# Altium project ESP32_RELAY.PrjPcb
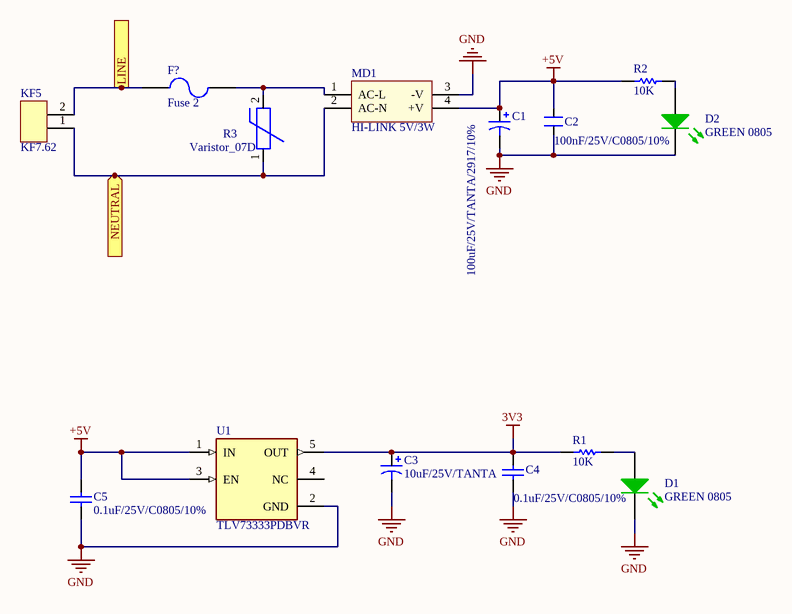
[diagram p0: [01]-POWER.SchDoc]
4 sheets, 92 parts. Net scope: flat (ports and power ports of the same name join across sheets).
Board file: PCB1.PcbDoc
Sheets:
  [01]-POWER.SchDoc
  [02]-ESP32.SchDoc
  [03]-USB-UART.SchDoc
  [04]-OUTPUT.SchDoc

## Sheet [01]-POWER.SchDoc
size A4; SheetNumber: 1; SheetTotal: 4

### Parts
C1  100uF/25V/TANTA/2917/10%  [CAP TANT CASE X SMD]
C2  100nF/25V/C0805/10%  [CAP_CERA_C2012(CC0805INCH)]
C3  10uF/25V/TANTA  [CAP TANT CASE B SMD]
C4  0.1uF/25V/C0805/10%  [CAP_CERA_C2012(CC0805INCH)]
C5  0.1uF/25V/C0805/10%  [CAP_CERA_C2012(CC0805INCH)]
D1  GREEN 0805  [Led 0805G]
D2  GREEN 0805  [Led 0805G]
F?  Fuse 2  [FUSE-BLX-A 5x20MM]
KF5  KF7.62  [KF-7.62]
MD1  HI-LINK 5V/3W  [HILINK 5V/3W]
R1  10K  [Res 0603 SMD]
R2  10K  [Res 0603 SMD]
R3  Varistor_07D  [Varistor_07D]
U1  TLV73333PDBVR  [SOT95P280X145-5N]

### Ports
LINE (in, see [04]-OUTPUT[2A], [04]-OUTPUT[2C], [04]-OUTPUT[4A], [04]-OUTPUT[4C]), NEUTRAL (in, see [04]-OUTPUT[2A], [04]-OUTPUT[2C], [04]-OUTPUT[4A], [04]-OUTPUT[4C])

### Nets
3V3: C3.1 C4.1 R1.1 U1.5(OUT)
+5V: C1.1 C2.2 C5.1 MD1.4(+V) R2.1 U1.1(IN) U1.3(EN)
GND: C1.2 C2.1 C3.2 C4.2 C5.2 D1.2(K) D2.2(K) MD1.3(-V) U1.2(GND)
LINE: F?.1 KF5.2 ; port LINE
NEUTRAL: KF5.1 MD1.2(AC-N) R3.1 ; port NEUTRAL
NetD1_1: D1.1(A) R1.2
NetD2_1: D2.1(A) R2.2
NetF?_2: F?.2 MD1.1(AC-L) R3.2

Not connected (* = marked no-connect by the designer): U1 4(NC)

### Notes on the sheet
- Title
- Size:
- Date:
- Author:
- A4
- Time:
- Number:
- Checked:
- Revision:
- Sheet
- Approved:
- of
- File:

### Library data of the parts
C1 = 100uF/6.3V/SIZE B/20%: CAP TANT 100UF 6.3V 20% 1411; Manufacturer: Kemet; Manufacturer Part Number: T491B107M006AT; Manufacturer Size Code: B; Capacitance: 100µF; ESR (Equivalent Series Resistance): 3 Ohm; Type: Molded; Lifetime @ Temp.: 2000 Hrs @ 85°C; RoHS: RoHS Compliant; Category: Capacitors; Packaging: Cut Tape (CT); Tolerance: ±20%; Voltage - Rated: 6.3V; Operating Temperature: -55°C ~ 125°C; Mounting Type: Surface Mount; Package / Case: 1411 (3528 Metric); Size / Dimension: 0.138" L x 0.110" W (3.50mm x 2.80mm); Height - Seated (Max): 0.083" (2.10mm); Lead Spacing: -; Features: General Purpose; ComponentLink1URL: http://www.kemet.com/Lists/ProductCatalog/Attachments/254/KEM_T2005_T491.pdf; ComponentLink1Description: http://www.kemet.com/Lists/ProductCatalog/Attachments/254/KEM_T2005_T491.pdf; Supplier 1: Digi-Key; Supplier Part Number 1: 399-3710-1-ND
C2 = CAP CERA 0805: CERAMIC CAP 0805; Value: 100pF, 2012
C3 = TAJB106M025RNJ: 10µF Molded Tantalum Capacitors 25V 1411 (3528 Metric) 3 Ohm; Manufacturer: KEMET; Digikey: 399-5125-1-ND
C4 C5 = 0.1uF/50V/C0603/10%_5: 0.1µF ±10% 25V Ceramic Capacitor X7R 0805 (2012 Metric); ComponentLink1URL: http://www.murata.com/~/media/webrenewal/support/library/catalog/products/capacitor/mlcc/c02e.ashx; ComponentLink1Description: http://www.murata.com/~/media/webrenewal/support/library/catalog/products/capacitor/mlcc/c02e.ashx; Digikey: 478-3755-1-ND
D1 D2 = LED GREEN 0603: Green 571nm LED Indication - Discrete 2V 0805 (2012 Metric); ComponentLink1URL: http://optoelectronics.liteon.com/upload/download/DS22-2000-074/S_110_LTST-C190KGKT.pdf; ComponentLink1Description: http://optoelectronics.liteon.com/upload/download/DS22-2000-074/S_110_LTST-C190KGKT.pdf; Digikey: 160-1426-1-ND
F? = Fuse 2: Fuse; Published: 8-Jun-2000; LatestRevisionDate: 17-Jul-2002; LatestRevisionNote: Re-released for DXP Platform.; PackageReference: PIN-W2/E2.8; Publisher: Altium Limited
KF5 = KF 2P
R1 R2 = 15K/R0603/1%_3: RES SMD 10K OHM 1% 1/10W 0603; Manufacturer: Yageo; Manufacturer Part Number: RC0603FR-0715KL; Resistance (Ohms): 15k; Power (Watts): 0.1W, 1/10W; Temperature Coefficient: ±100ppm/°C; RoHS: RoHS Compliant; Category: Resistors; Packaging: Digi-Reel®; Tolerance: ±1%; Composition: Thick Film; Features: Moisture Resistant; Operating Temperature: -55°C ~ 155°C; Package / Case: 0603 (1608 Metric); Supplier Device Package: 0603; Size / Dimension: 0.063" L x 0.031" W (1.60mm x 0.80mm); Height: 0.022" (0.55mm); Number of Terminations: 2; ComponentLink1URL: http://www.yageo.com/NewPortal/yageodocoutput?fileName=/pdf/R-Chip/PYu-RC_Group_51_RoHS_L_3.pdf; ComponentLink1Description: http://www.yageo.com/NewPortal/yageodocoutput?fileName=/pdf/R-Chip/PYu-RC_Group_51_RoHS_L_3.pdf; Supplier 1: Digi-Key; Supplier Part Number 1: 311-15.0KHRCT-ND
U1 = TLV73333PDBVR: 300-mA, capacitor-free, low-IQ, low-dropout voltage regulator with enable; MF: Texas Instruments; SnapEDA_Link: https://www.snapeda.com/parts/TLV73333PDBVR/Texas+Instruments/view-part/?ref=snap; Package: SOT-23-5 Texas Instruments; Value: *; MP: TLV73333PDBVR; Check_prices: https://www.snapeda.com/parts/TLV73333PDBVR/Texas+Instruments/view-part/?ref=eda

## Sheet [02]-ESP32.SchDoc
size A4; SheetNumber: 2; SheetTotal: 4
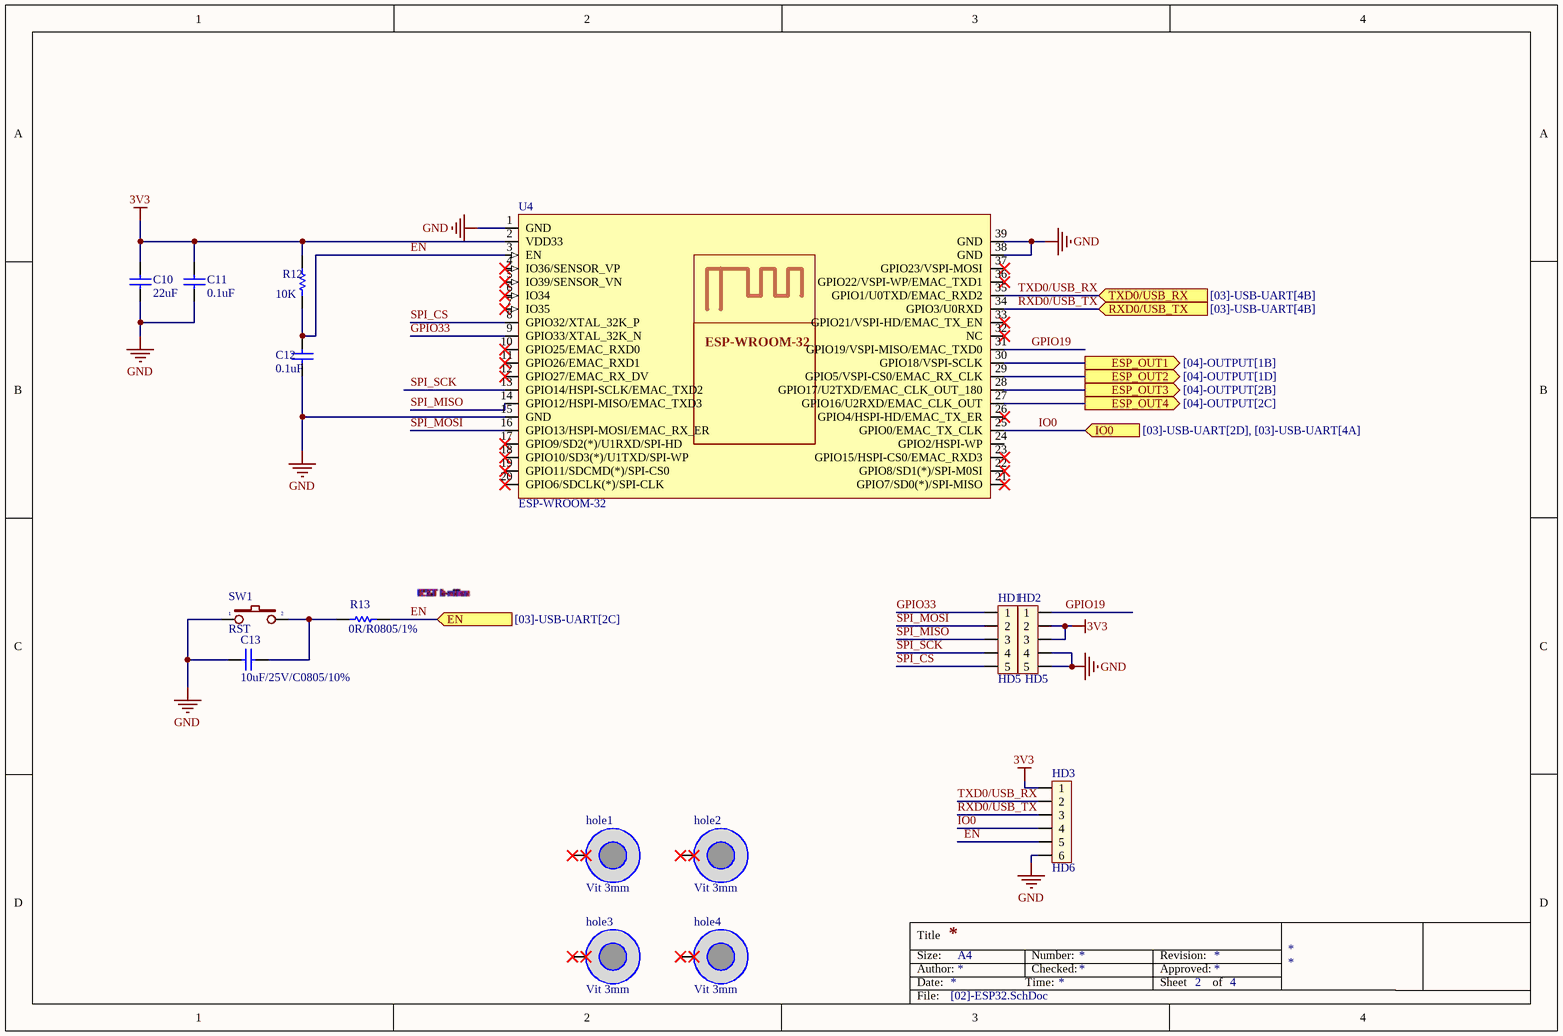
[diagram p1: [02]-ESP32.SchDoc]

### Parts
C10  22uF  [CAP_CERA_C2012(CC0805INCH)]
C11  0.1uF  [CAP_CERA_C2012(CC0805INCH)]
C12  0.1uF  [CAP_CERA_C2012(CC0805INCH)]
C13  10uF/25V/C0805/10%  [CAP_CERA_C2012(CC0805INCH)]
HD1  HD5  [Header_5]
HD2  HD5  [Header_5]
HD3  HD6  [Header_6]
hole1  Vit 3mm  [Screw 3.0]
hole2  Vit 3mm  [Screw 3.0]
hole3  Vit 3mm  [Screw 3.0]
hole4  Vit 3mm  [Screw 3.0]
R12  10K  [Res 0805 SMD]
R13  0R/R0805/1%  [Res 0805 SMD]
SW1  RST  [Button 3x4mm]
U4  ESP-WROOM-32  [ESP32 WROOM]

### Ports
EN (in, see [03]-USB-UART[2C]), ESP_OUT1 (out, see [04]-OUTPUT[1B]), ESP_OUT2 (out, see [04]-OUTPUT[1D]), ESP_OUT3 (out, see [04]-OUTPUT[2B]), ESP_OUT4 (out, see [04]-OUTPUT[2C]), IO0 (in, see [03]-USB-UART[2D], [03]-USB-UART[4A]), RXD0/USB_TX (in, see [03]-USB-UART[4B]), TXD0/USB_RX (in, see [03]-USB-UART[4B])

### Nets
3V3: C10.2 C11.2 HD2.2 HD2.3 HD3.1 R12.2 U4.2(VDD33)
GND: C10.1 C11.1 C12.1 C13.1 HD2.4 HD2.5 HD3.6 SW1.1 U4.1(GND) U4.15(GND) U4.38(GND) U4.39(GND)
EN: C12.2 HD3.5 R12.1 R13.2 U4.3(EN) ; port EN
ESP_OUT1: U4.30(GPIO18/VSPI-SCLK) ; port ESP_OUT1
ESP_OUT2: U4.29(GPIO5/VSPI-CS0/EMAC_RX_CLK) ; port ESP_OUT2
ESP_OUT3: U4.28(GPIO17/U2TXD/EMAC_CLK_OUT_180) ; port ESP_OUT3
ESP_OUT4: U4.27(GPIO16/U2RXD/EMAC_CLK_OUT) ; port ESP_OUT4
GPIO19: HD2.1 U4.31(GPIO19/VSPI-MISO/EMAC_TXD0)
GPIO33: HD1.1 U4.9(GPIO33/XTAL_32K_N)
IO0: HD3.4 U4.25(GPIO0/EMAC_TX_CLK) ; port IO0
RXD0/USB_TX: HD3.3 U4.34(GPIO3/U0RXD) ; port RXD0/USB_TX
SPI_CS: HD1.5 U4.8(GPIO32/XTAL_32K_P)
SPI_MISO: HD1.3 U4.14(GPIO12/HSPI-MISO/EMAC_TXD3)
SPI_MOSI: HD1.2 U4.16(GPIO13/HSPI-MOSI/EMAC_RX_ER)
SPI_SCK: HD1.4 U4.13(GPIO14/HSPI-SCLK/EMAC_TXD2)
TXD0/USB_RX: HD3.2 U4.35(GPIO1/U0TXD/EMAC_RXD2) ; port TXD0/USB_RX
NetC13_2: C13.2 R13.1 SW1.2

Not connected (* = marked no-connect by the designer): hole1 1(hole)*; hole2 1(hole)*; hole3 1(hole)*; hole4 1(hole)*; U4 4(IO36/SENSOR_VP)* 5(IO39/SENSOR_VN)* 6(IO34)* 7(IO35)* 10(GPIO25/EMAC_RXD0)* 11(GPIO26/EMAC_RXD1)* 12(GPIO27/EMAC_RX_DV)* 17(GPIO9/SD2(*)/U1RXD/SPI-HD)* 18(GPIO10/SD3(*)/U1TXD/SPI-WP)* 19(GPIO11/SDCMD(*)/SPI-CS0)* 20(GPIO6/SDCLK(*)/SPI-CLK)* 21(GPIO7/SD0(*)/SPI-MISO)* 22(GPIO8/SD1(*)/SPI-M0SI)* 23(GPIO15/HSPI-CS0/EMAC_RXD3)* 24(GPIO2/HSPI-WP) 26(GPIO4/HSPI-HD/EMAC_TX_ER)* 32(NC)* 33(GPIO21/VSPI-HD/EMAC_TX_EN)* 36(GPIO22/VSPI-WP/EMAC_TXD1)* 37(GPIO23/VSPI-MOSI)*

### Notes on the sheet
- Title
- Size:
- Date:
- Author:
- A4
- Time:
- Number:
- Checked:
- Revision:
- Sheet
- Approved:
- of
- File:

### Library data of the parts
C10 = 0.1uF/50V/C0603/10%_1: 22µF ±20% 25V Ceramic Capacitor X5R 0805 (2012 Metric); Manufacturer: Tariff Applied; ComponentLink1URL: http://www.murata.com/~/media/webrenewal/support/library/catalog/products/capacitor/mlcc/c02e.ashx; ComponentLink1Description: http://www.murata.com/~/media/webrenewal/support/library/catalog/products/capacitor/mlcc/c02e.ashx; Digikey: 1276-2908-1-ND
C11 C12 = 0.1uF/50V/C0603/10%_2: 0.1µF ±10% 25V Ceramic Capacitor X7R 0805 (2012 Metric); ComponentLink1URL: http://www.murata.com/~/media/webrenewal/support/library/catalog/products/capacitor/mlcc/c02e.ashx; ComponentLink1Description: http://www.murata.com/~/media/webrenewal/support/library/catalog/products/capacitor/mlcc/c02e.ashx; Digikey: 478-3755-1-ND
C13 = 0.1uF/50V/C0603/10%_6: 0.1µF ±10% 25V Ceramic Capacitor X7R 0805 (2012 Metric); ComponentLink1URL: http://www.murata.com/~/media/webrenewal/support/library/catalog/products/capacitor/mlcc/c02e.ashx; ComponentLink1Description: http://www.murata.com/~/media/webrenewal/support/library/catalog/products/capacitor/mlcc/c02e.ashx; Digikey: 478-3755-1-ND
HD1 HD2 = Header5: Header 5; Creat by: VanDungEvn@Gmail.com
HD3 = Header6: Header 6; Creat by: VanDungEvn@Gmail.com
R12 = 34.8K/R0805/1%_2: 10 kOhms ±1% 0.125W, 1/8W Chip Resistor 0805 (2012 Metric) Thick Film; Power Rating: 100mW; Resistance: 34.8kR; Voltage Rating: 50V; Case/Package: 0603; Case Code (Imperial): 0603; Case Code (Metric): 1608; Min Operating Temperature: -55°C; Max Operating Temperature: 155°C; Termination: SMD/SMT; Military Standard: Not; Voltage Rating (DC): 50V; Length: 1.6mm; Height: 0.45mm; Width: 0.8mm; Depth: 0.8mm; Lead Free: Lead Free; Digikey: A126332CT-ND
R13 = 200K/R0603/1%_1: 0 Ohms Jumper 0.125W, 1/8W Chip Resistor 0805 (2012 Metric) Automotive AEC-Q200 Thick Film; Part Status: Active; Height - Seated (Max): 0.022" (0.55mm); Failure Rate: -; ComponentLink1URL: http://www.yageo.com/documents/recent/PYu-RC_Group_51_RoHS_L_7.pdf; ComponentLink1Description: http://www.yageo.com/documents/recent/PYu-RC_Group_51_RoHS_L_7.pdf; Digikey: 541-0.0ACT-ND
SW1 = SW2: SWITCH TACTILE SPST-NO 0.05A 12V; Digikey: CKN10384CT-ND

## Sheet [03]-USB-UART.SchDoc
size A4; SheetNumber: 3; SheetTotal: 4
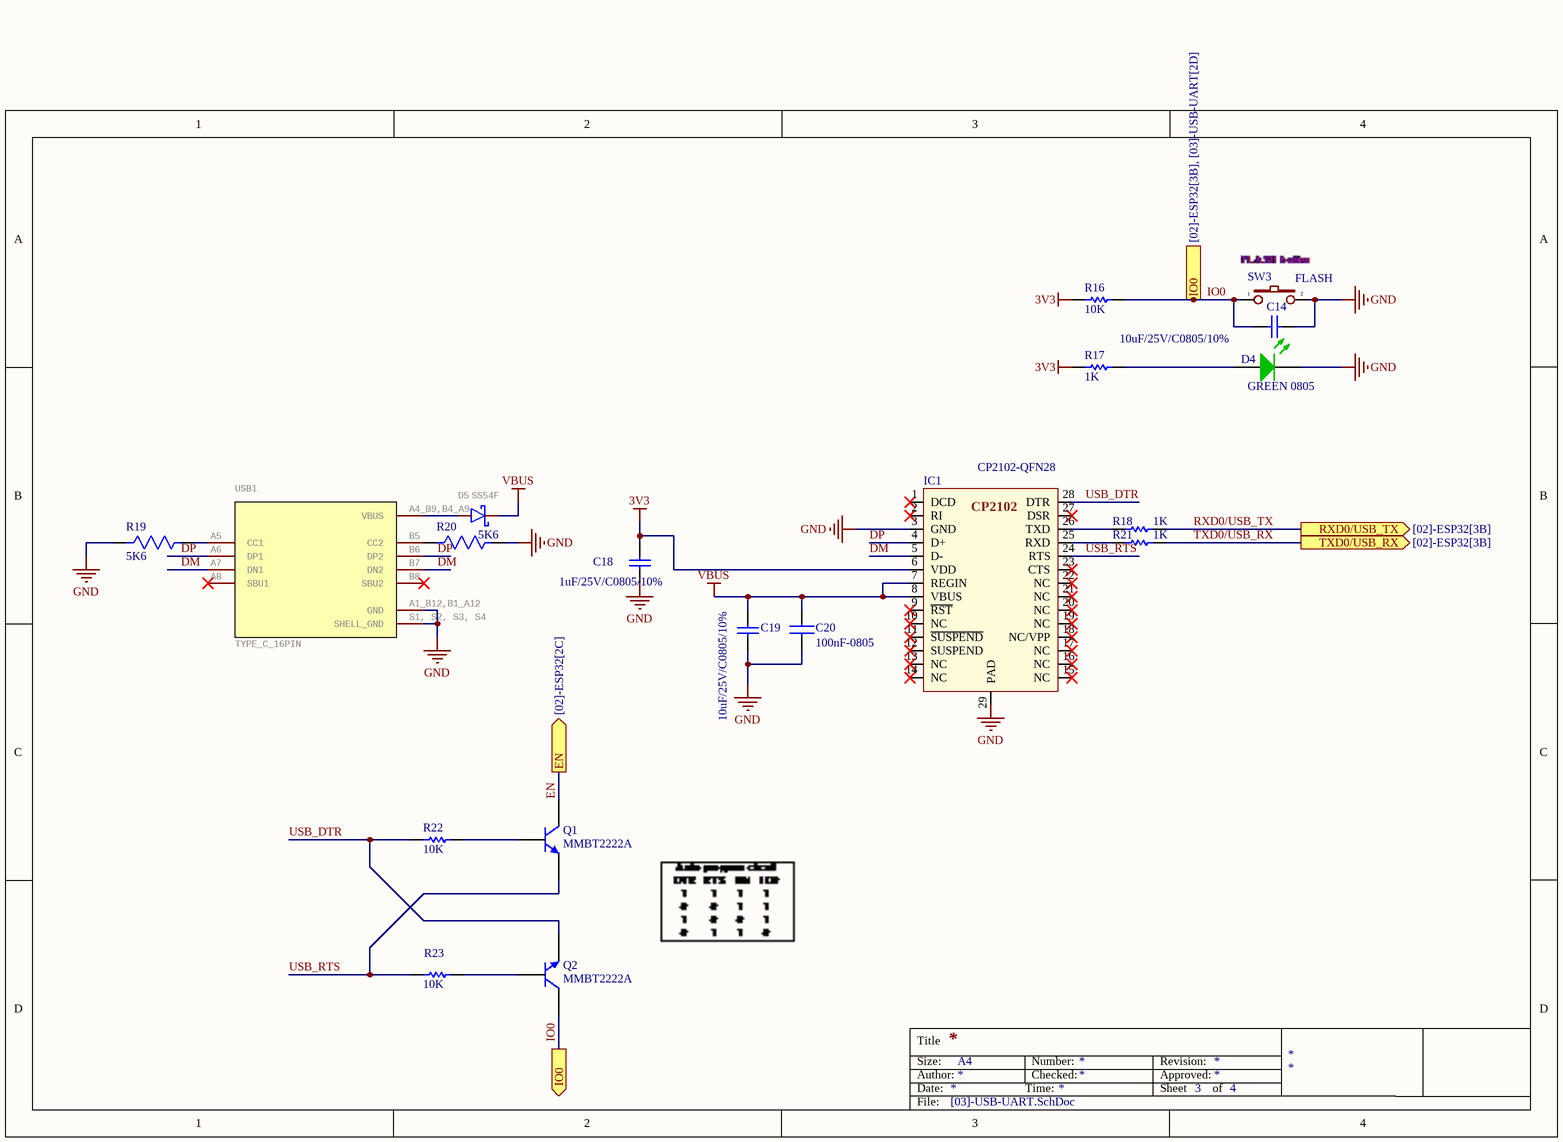
[diagram p2: [03]-USB-UART.SchDoc]

### Parts
C14  10uF/25V/C0805/10%  [CAP_CERA_C2012(CC0805INCH)]
C18  1uF/25V/C0805/10%  [CAP_CERA_C2012(CC0805INCH)]
C19  10uF/25V/C0805/10%  [CAP_CERA_C2012(CC0805INCH)]
C20  100nF-0805  [CAP0805]
D4  GREEN 0805  [Led 0805G]
D5  SS54F  [SMAF]
IC1  CP2102-QFN28  [CP2102-QFN28]
Q1  MMBT2222A  [SOT23-3]
Q2  MMBT2222A  [SOT23-3]
R16  10K  [Res 0805 SMD]
R17  1K  [Res 0805 SMD]
R18  1K  [Res 0603 SMD]
R19  5K6  [R0805]
R20  5K6  [R0805]
R21  1K  [Res 0603 SMD]
R22  10K  [Res 0805 SMD]
R23  10K  [Res 0805 SMD]
SW3  FLASH  [Button 3x4mm]
USB1  TYPE_C_16PIN  [USB_TYPEC_16PIN]

### Ports
EN (out, see [02]-ESP32[2C]), IO0 (out, see [02]-ESP32[3B], [03]-USB-UART[2D]), IO0 (out, see [02]-ESP32[3B], [03]-USB-UART[4A]), RXD0/USB_TX (out, see [02]-ESP32[3B]), TXD0/USB_RX (out, see [02]-ESP32[3B])

### Nets
3V3: C18.1 IC1.6(VDD) R16.1 R17.1
GND: C14.2 C18.2 C19.1 C20.2 D4.2(K) IC1.3(GND) IC1.29(PAD) R19.1 R20.2 SW3.2 USB1.A1_B12,B1_A12(GND) USB1.S1,_S2,_S3,_S4(SHELL_GND)
VBUS: C19.2 C20.1 D5.C IC1.7(REGIN) IC1.8(VBUS)
DM: IC1.5(D-) USB1.A7(DN1) USB1.B7(DN2)
DP: IC1.4(D+) USB1.A6(DP1) USB1.B6(DP2)
EN: Q1.3(C) ; port EN
IO0: C14.1 Q2.3(C) R16.2 SW3.1 ; port IO0
RXD0/USB_TX: R18.2 ; port RXD0/USB_TX
TXD0/USB_RX: R21.2 ; port TXD0/USB_RX
USB_DTR: IC1.28(DTR) Q2.2(E) R22.1
USB_RTS: IC1.24(RTS) Q1.2(E) R23.1
NetD4_1: D4.1(A) R17.2
NetD5_A: D5.A USB1.A4_B9,B4_A9(VBUS)
NetIC1_25: IC1.25(RXD) R21.1
NetIC1_26: IC1.26(TXD) R18.1
NetQ1_1: Q1.1(B) R22.2
NetQ2_1: Q2.1(B) R23.2
NetR19_2: R19.2 USB1.A5(CC1)
NetR20_1: R20.1 USB1.B5(CC2)

Not connected (* = marked no-connect by the designer): IC1 1(DCD)* 2(RI)* 9(~{RST})* 10(NC)* 11(~{SUSPEND})* 12(SUSPEND)* 13(NC)* 14(NC)* 15(NC)* 16(NC)* 17(NC)* 18(NC/VPP)* 19(NC)* 20(NC)* 21(NC)* 22(NC)* 23(CTS)* 27(DSR)*; USB1 A8(SBU1)* B8(SBU2)*

### Notes on the sheet
- Title
- Size:
- Date:
- Author:
- A4
- Time:
- Number:
- Checked:
- Revision:
- Sheet
- Approved:
- of
- File:

### Library data of the parts
C14 C18 C19 = 0.1uF/50V/C0603/10%_6: as C13 on sheet [02]-ESP32; ComponentLink1URL: http://www.murata.com/~/media/webrenewal/support/library/catalog/products/capacitor/mlcc/c02e.ashx; ComponentLink1Description: http://www.murata.com/~/media/webrenewal/support/library/catalog/products/capacitor/mlcc/c02e.ashx; Digikey: 478-3755-1-ND
C20 = CC0805KRX7R9BB104: CAP CER 0.1UF 50V X7R 0805; Manufacturer: Yageo; Tolerance: ±10%; Notification: Current market demand for these product types have resulted in fluctuating and extending lead times. Lead times may differ.; Supplier 1: Digi-Key; Manufacturer Part Number: CC0805KRX7R9BB104; RoHS: RoHS Compliant; Category: Capacitors; Stock 1: 0; Pricing 1: 1=0.13, 10=0.093, 100=0.0439, 500=0.03076, 1000=0.02547 (USD); Packaging: Cut Tape (CT); Part Status: Active; Voltage - Rated: 50V; Temperature Coefficient: X7R; Operating Temperature: -55°C ~ 125°C; Features: High Voltage; Ratings: -; Applications: General Purpose; Failure Rate: -; Mounting Type: Surface Mount, MLCC; Package / Case: 0805 (2012 Metric); Size / Dimension: 0.079" L x 0.049" W (2.00mm x 1.25mm); Height - Seated (Max): -; Thickness (Max): 0.033" (0.85mm); Lead Spacing: -; Lead Style: -; ComponentLink1URL: http://www.yageo.com/documents/recent/UPY-GPHC_X7R_6.3V-to-50V_18.pdf; ComponentLink1Description: http://www.yageo.com/documents/recent/UPY-GPHC_X7R_6.3V-to-50V_18.pdf; Supplier Part Number 1: 311-1140-1-ND
D4 = LED GREEN 0603: as D1 on sheet [01]-POWER; ComponentLink1URL: http://optoelectronics.liteon.com/upload/download/DS22-2000-074/S_110_LTST-C190KGKT.pdf; ComponentLink1Description: http://optoelectronics.liteon.com/upload/download/DS22-2000-074/S_110_LTST-C190KGKT.pdf; Digikey: 160-1426-1-ND
D5 = SS54F: GateName_1: G$1; SymbolName_1: DIODE_S; LibraryName: Uy_SMD; DeviceSetName: SS54F; Package: SMAF
IC1 = CP2102: USB Bridge, USB to UART USB 2.0 UART Interface 28-QFN (5x5); Digikey: 336-3694-ND; VNBuy: https://banlinhkien.vn/goods-2607-cp2102-qfn28.html
Q1 Q2 = MMBT2222A: TRANS NPN 40V 1A SOT-23; Manufacturer: ON Semiconductor; Vce Saturation (Max) @ Ib, Ic: 1V @ 50mA, 500mA; Current - Collector Cutoff (Max): 10nA (ICBO); DC Current Gain (hFE) (Min) @ Ic, Vce: 100 @ 150mA, 10V; Frequency - Transition: 300MHz; Supplier 1: Digi-Key; Manufacturer Part Number: MMBT2222A; RoHS: RoHS Compliant; Category: Discrete Semiconductor Products; Stock 1: 220769; Pricing 1: 1=0.21, 10=0.17, 100=0.09, 500=0.05922, 1000=0.04027 (USD); Packaging: Cut Tape (CT); Part Status: Last Time Buy; Transistor Type: NPN; Operating Temperature: 150°C (TJ); Mounting Type: Surface Mount; Package / Case: TO-236-3, SC-59, SOT-23-3; Supplier Device Package: SOT-23-3; Base Part Number: MMBT2222; ComponentLink1URL: https://www.fairchildsemi.com/datasheets/MM/MMBT2222A.pdf; ComponentLink1Description: https://www.fairchildsemi.com/datasheets/MM/MMBT2222A.pdf; Supplier Part Number 1: MMBT2222AFSCT-ND
R16 R22 R23 = 34.8K/R0805/1%_2: as R12 on sheet [02]-ESP32; Case/Package: 0603; Case Code (Imperial): 0603; Case Code (Metric): 1608; Min Operating Temperature: -55°C; Max Operating Temperature: 155°C; Termination: SMD/SMT; Military Standard: Not; Voltage Rating (DC): 50V; Length: 1.6mm; Height: 0.45mm; Width: 0.8mm; Depth: 0.8mm; Lead Free: Lead Free; Digikey: A126332CT-ND
R17 = 34.8K/R0805/1%: 1 kOhms ±1% 0.125W, 1/8W Chip Resistor 0805 (2012 Metric) Automotive AEC-Q200 Thick Film; Power Rating: 100mW; Resistance: 34.8kR; Voltage Rating: 50V; Case/Package: 0603; Case Code (Imperial): 0603; Case Code (Metric): 1608; Min Operating Temperature: -55°C; Max Operating Temperature: 155°C; Termination: SMD/SMT; Military Standard: Not; Voltage Rating (DC): 50V; Length: 1.6mm; Height: 0.45mm; Width: 0.8mm; Depth: 0.8mm; Lead Free: Lead Free; Digikey: 541-1.00KCCT-ND
R18 R21 = 15K/R0603/1%: RES SMD 1K OHM 1% 1/10W 0603; Manufacturer: Yageo; Manufacturer Part Number: RC0603FR-0715KL; Resistance (Ohms): 15k; Power (Watts): 0.1W, 1/10W; Temperature Coefficient: ±100ppm/°C; RoHS: RoHS Compliant; Category: Resistors; Packaging: Digi-Reel®; Tolerance: ±1%; Composition: Thick Film; Features: Moisture Resistant; Operating Temperature: -55°C ~ 155°C; Package / Case: 0603 (1608 Metric); Supplier Device Package: 0603; Size / Dimension: 0.063" L x 0.031" W (1.60mm x 0.80mm); Height: 0.022" (0.55mm); Number of Terminations: 2; ComponentLink1URL: http://www.yageo.com/NewPortal/yageodocoutput?fileName=/pdf/R-Chip/PYu-RC_Group_51_RoHS_L_3.pdf; ComponentLink1Description: http://www.yageo.com/NewPortal/yageodocoutput?fileName=/pdf/R-Chip/PYu-RC_Group_51_RoHS_L_3.pdf; Supplier 1: Digi-Key; Supplier Part Number 1: 311-15.0KHRCT-ND
R19 R20 = Resistor 0805: SMD Resistor 0805; Manufacturer: Yageo; Manufacturer Part Number: RC0603FR-071KL; Power Rating: 100mW; Tolerance: 1%; Temperature Coefficient: 100ppm/°C; Voltage Rating: 50V; Supplier: Digi-Key; Supplier Part Number: 311-1.00KHRDKR-ND; RoHS: Yes; Category: Chip SMD Resistors; Stock: 18662657; Pricing: 1=0.1, 10=0.018, 50=0.0106, 100=0.0088, 500=0.00592, 1000=0.00505 (USD); Case/Package: 0603; Case Code (Imperial): 0603; Case Code (Metric): 1608; Contact Plating: Tin,Matte; Min Operating Temperature: -55°C; Max Operating Temperature: 155°C; Packaging: Tape and Reel; Resistor Type: Thick Film; Termination: SMD/SMT; Features: Moisture Resistant; Series: RC; Max Power Dissipation: 100mW; Number of Terminations: 2; Resistance Tolerance: 1%; Construction: Rectangular; Technology: THICK FILM; Length: 1.6mm; Height: 0.45mm; Depth: 0.8mm; Reach SVHC Compliant: No; Military Standard: Not; Lead Free: 5697LeadFree; RoHS Compliant: Yes
SW3 = SW2: SWITCH TACTILE SPST-NO 0.05A 12V; Digikey: CKN10384CT-ND
USB1 = TYPE_C_16PIN: GateName_1: G$1; SymbolName_1: USB4105-GF-A; DeviceSetName: TYPE_C_FEMALE; MF: GCT; LibraryName: Uy_SMD; Package: GCT_USB4105-GF-A; AVAILABILITY: Warning; MP: USB4105-GF-A; PACKAGE: None; PRICE: None

## Sheet [04]-OUTPUT.SchDoc
size A4; SheetNumber: 4; SheetTotal: 4
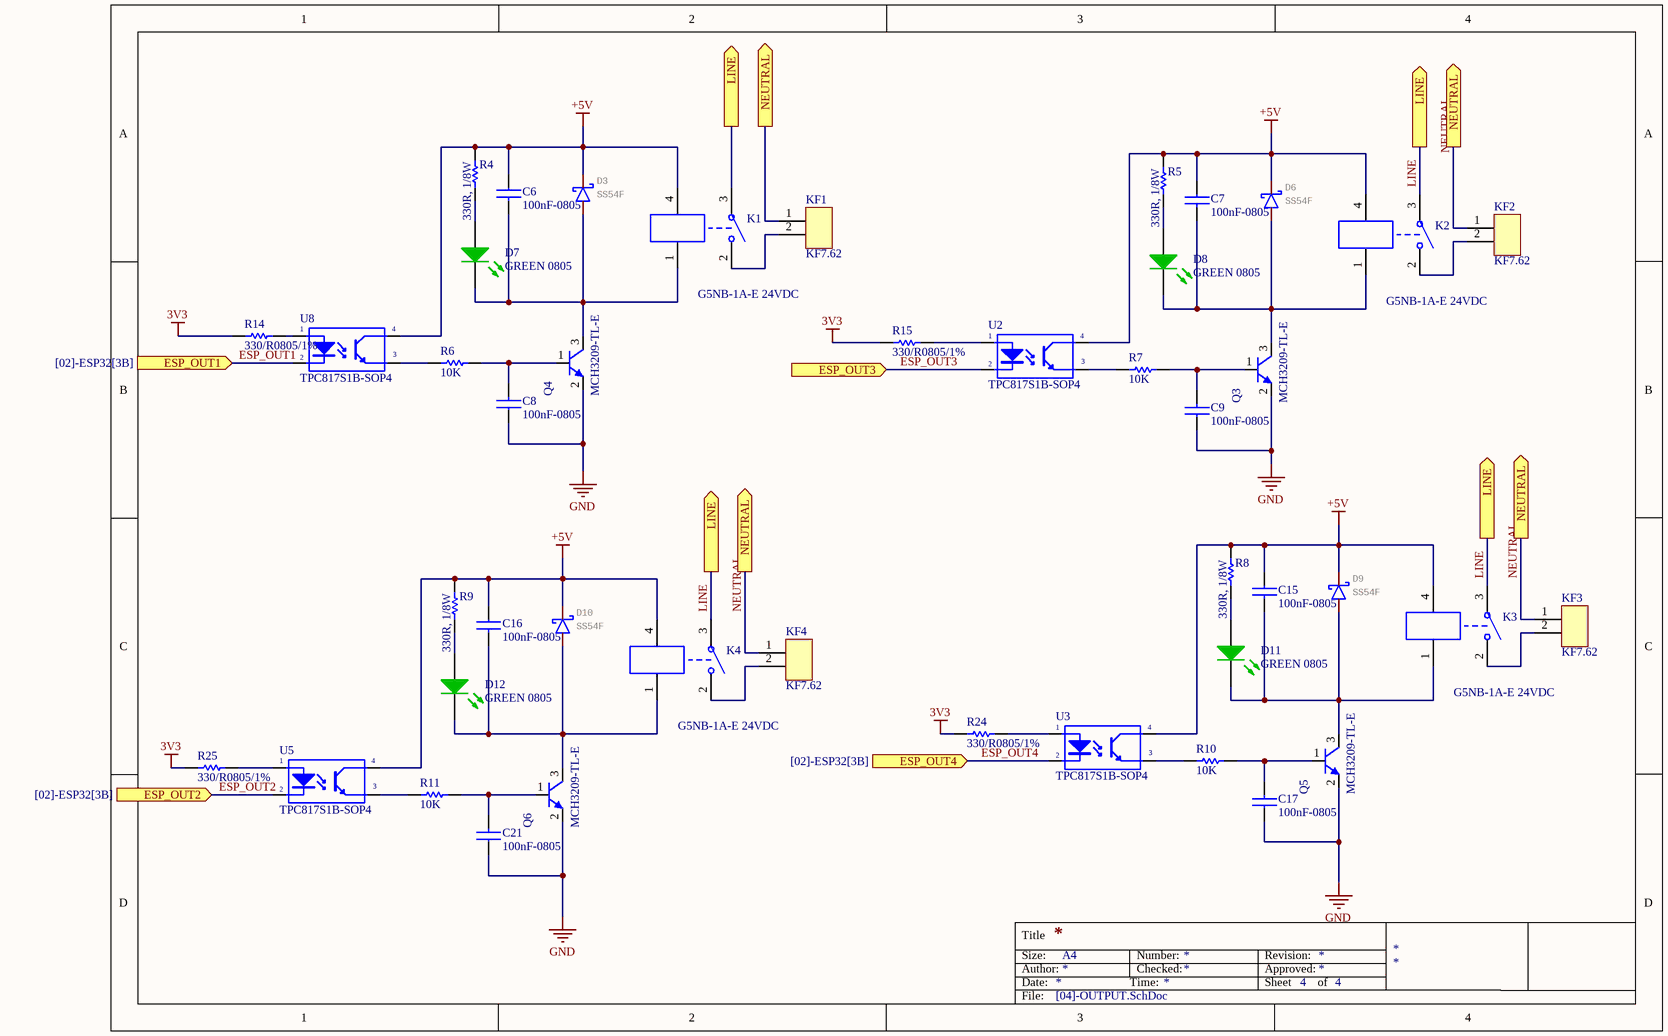
[diagram p3: [04]-OUTPUT.SchDoc]

### Parts
C6  100nF-0805  [CAP0805]
C7  100nF-0805  [CAP0805]
C8  100nF-0805  [CAP0805]
C9  100nF-0805  [CAP0805]
C15  100nF-0805  [CAP0805]
C16  100nF-0805  [CAP0805]
C17  100nF-0805  [CAP0805]
C21  100nF-0805  [CAP0805]
D3  SS54F  [SMAF]
D6  SS54F  [SMAF]
D7  GREEN 0805  [Led 0805G]
D8  GREEN 0805  [Led 0805G]
D9  SS54F  [SMAF]
D10  SS54F  [SMAF]
D11  GREEN 0805  [Led 0805G]
D12  GREEN 0805  [Led 0805G]
K1  G5NB-1A-E 24VDC  [RELAY-G5NB-1A-E 24VDC]
K2  G5NB-1A-E 24VDC  [RELAY-G5NB-1A-E 24VDC]
K3  G5NB-1A-E 24VDC  [RELAY-G5NB-1A-E 24VDC]
K4  G5NB-1A-E 24VDC  [RELAY-G5NB-1A-E 24VDC]
KF1  KF7.62  [KF-7.62]
KF2  KF7.62  [KF-7.62]
KF3  KF7.62  [KF-7.62]
KF4  KF7.62  [KF-7.62]
Q3  MCH3209-TL-E  [MCH3209-TL-E  SOT-323]
Q4  MCH3209-TL-E  [MCH3209-TL-E  SOT-323]
Q5  MCH3209-TL-E  [MCH3209-TL-E  SOT-323]
Q6  MCH3209-TL-E  [MCH3209-TL-E  SOT-323]
R4  value 330R, 1/8W  [RESC2012L]  (hidden comment: CR05JL7-330R)
R5  value 330R, 1/8W  [RESC2012L]  (hidden comment: CR05JL7-330R)
R6  10K  [Res 0805 SMD]
R7  10K  [Res 0805 SMD]
R8  value 330R, 1/8W  [RESC2012L]  (hidden comment: CR05JL7-330R)
R9  value 330R, 1/8W  [RESC2012L]  (hidden comment: CR05JL7-330R)
R10  10K  [Res 0805 SMD]
R11  10K  [Res 0805 SMD]
R14  330/R0805/1%  [Res 0805 SMD]
R15  330/R0805/1%  [Res 0805 SMD]
R24  330/R0805/1%  [Res 0805 SMD]
R25  330/R0805/1%  [Res 0805 SMD]
U2  TPC817S1B-SOP4  [TPC817-4SOP]
U3  TPC817S1B-SOP4  [TPC817-4SOP]
U5  TPC817S1B-SOP4  [TPC817-4SOP]
U8  TPC817S1B-SOP4  [TPC817-4SOP]

### Ports
ESP_OUT1 (in, see [02]-ESP32[3B]), ESP_OUT2 (in, see [02]-ESP32[3B]), ESP_OUT3 (in, see [02]-ESP32[3B]), ESP_OUT4 (in, see [02]-ESP32[3B]), LINE (out, see [01]-POWER[1B], [04]-OUTPUT[2A], [04]-OUTPUT[2C], [04]-OUTPUT[4A]), LINE (out, see [01]-POWER[1B], [04]-OUTPUT[2A], [04]-OUTPUT[2C], [04]-OUTPUT[4C]), LINE (out, see [01]-POWER[1B], [04]-OUTPUT[2A], [04]-OUTPUT[4A], [04]-OUTPUT[4C]), LINE (out, see [01]-POWER[1B], [04]-OUTPUT[2C], [04]-OUTPUT[4A], [04]-OUTPUT[4C]), NEUTRAL (out, see [01]-POWER[1B], [04]-OUTPUT[2A], [04]-OUTPUT[2C], [04]-OUTPUT[4A]), NEUTRAL (out, see [01]-POWER[1B], [04]-OUTPUT[2A], [04]-OUTPUT[2C], [04]-OUTPUT[4C]), NEUTRAL (out, see [01]-POWER[1B], [04]-OUTPUT[2A], [04]-OUTPUT[4A], [04]-OUTPUT[4C]), NEUTRAL (out, see [01]-POWER[1B], [04]-OUTPUT[2C], [04]-OUTPUT[4A], [04]-OUTPUT[4C])

### Nets
3V3: R14.1 R15.1 R24.1 R25.1
+5V: C6.1 C7.1 C15.1 C16.1 D3.C D6.C D9.C D10.C K1.4 K2.4 K3.4 K4.4 R4.2 R5.2 R8.2 R9.2 U2.4(C) U3.4(C) U5.4(C) U8.4(C)
GND: C8.1 C9.1 C17.1 C21.1 Q3.2(E) Q4.2(E) Q5.2(E) Q6.2(E)
ESP_OUT1: U8.2(K) ; port ESP_OUT1
ESP_OUT2: U5.2(K) ; port ESP_OUT2
ESP_OUT3: U2.2(K) ; port ESP_OUT3
ESP_OUT4: U3.2(K) ; port ESP_OUT4
LINE: K1.3(NO) K2.3(NO) K3.3(NO) K4.3(NO) ; port LINE
NEUTRAL: KF1.1 KF2.1 KF3.1 KF4.1 ; port NEUTRAL
NetC6_2: C6.2 D3.A D7.2(K) K1.1(COM) Q4.3(C)
NetC7_2: C7.2 D6.A D8.2(K) K2.1(COM) Q3.3(C)
NetC8_2: C8.2 Q4.1(B) R6.1
NetC9_2: C9.2 Q3.1(B) R7.1
NetC15_2: C15.2 D9.A D11.2(K) K3.1(COM) Q5.3(C)
NetC16_2: C16.2 D10.A D12.2(K) K4.1(COM) Q6.3(C)
NetC17_2: C17.2 Q5.1(B) R10.1
NetC21_2: C21.2 Q6.1(B) R11.1
NetD7_1: D7.1(A) R4.1
NetD8_1: D8.1(A) R5.1
NetD11_1: D11.1(A) R8.1
NetD12_1: D12.1(A) R9.1
NetK1_2: K1.2(NC) KF1.2
NetK2_2: K2.2(NC) KF2.2
NetK3_2: K3.2(NC) KF3.2
NetK4_2: K4.2(NC) KF4.2
NetR6_2: R6.2 U8.3(E)
NetR7_2: R7.2 U2.3(E)
NetR10_2: R10.2 U3.3(E)
NetR11_2: R11.2 U5.3(E)
NetR14_2: R14.2 U8.1(A)
NetR15_2: R15.2 U2.1(A)
NetR24_2: R24.2 U3.1(A)
NetR25_2: R25.2 U5.1(A)

### Notes on the sheet
- Title
- Size:
- Date:
- Author:
- A4
- Time:
- Number:
- Checked:
- Revision:
- Sheet
- Approved:
- of
- File:

### Library data of the parts
C6-C9 C15-C17 C21 = CC0805KRX7R9BB104: as C20 on sheet [03]-USB-UART; Supplier 1: Digi-Key; Manufacturer Part Number: CC0805KRX7R9BB104; RoHS: RoHS Compliant; Category: Capacitors; Stock 1: 0; Pricing 1: 1=0.13, 10=0.093, 100=0.0439, 500=0.03076, 1000=0.02547 (USD); Packaging: Cut Tape (CT); Part Status: Active; Voltage - Rated: 50V; Temperature Coefficient: X7R; Operating Temperature: -55°C ~ 125°C; Features: High Voltage; Ratings: -; Applications: General Purpose; Failure Rate: -; Mounting Type: Surface Mount, MLCC; Package / Case: 0805 (2012 Metric); Size / Dimension: 0.079" L x 0.049" W (2.00mm x 1.25mm); Height - Seated (Max): -; Thickness (Max): 0.033" (0.85mm); Lead Spacing: -; Lead Style: -; ComponentLink1URL: http://www.yageo.com/documents/recent/UPY-GPHC_X7R_6.3V-to-50V_18.pdf; ComponentLink1Description: http://www.yageo.com/documents/recent/UPY-GPHC_X7R_6.3V-to-50V_18.pdf; Supplier Part Number 1: 311-1140-1-ND
D3 D6 D9 D10 = SS54F: GateName_1: G$1; SymbolName_1: DIODE_S; LibraryName: Uy_SMD; DeviceSetName: SS54F; Package: SMAF
D7 D8 D11 D12 = LED GREEN 0603: as D1 on sheet [01]-POWER; ComponentLink1URL: http://optoelectronics.liteon.com/upload/download/DS22-2000-074/S_110_LTST-C190KGKT.pdf; ComponentLink1Description: http://optoelectronics.liteon.com/upload/download/DS22-2000-074/S_110_LTST-C190KGKT.pdf; Digikey: 160-1426-1-ND
K1-K4 = Relay-G5NB-1A-E 24VDC: Relay 24VDC SPST-NO General Purpose / Industrial; Published: 24-Mar-1999; LatestRevisionDate: 17-Jul-2002; LatestRevisionNote: Re-released for DXP Platform.; PackageReference: DIP-P8; Publisher: Altium Limited
KF1-KF4 = KF 2P
Q3-Q6 = 2SC1815: Bipolar (BJT) Transistor NPN 30V 3A 450MHz 800mW Surface Mount 3-MCPH; ComponentLink1Description: Datasheet; ComponentLink1URL: D:\Dropbox\Datasheets\Transistors\P Channel Bipolar\2SC1815.pdf; Digikey: MCH3209-TL-EOSCT-ND
R4 R5 R8 R9 = CR05JL7-330R: RES CR 0805 5% 1/8W 330R; Unit Price: 0.000802; ComponentLink1Description: Datasheet; ComponentLink1URL: D:\Dropbox\Datasheets\Passive Components\Resistors\Thick Film Chip Resistor CR.pdf
R6 R7 R10 R11 R14 R15 R24 R25 = 249K/R0805/1%: RES SMD 249K OHM 1% 1/10W 0805; Manufacturer: Yageo; Manufacturer Part Number: RC0603FR-07249KL; Power (Watts): 0.1W, 1/10W; Temperature Coefficient: ±100ppm/°C; Supplier 1: Digi-Key; RoHS: RoHS Compliant; Category: Resistors; Stock 1: 370515; Pricing 1: 1=0.1, 10=0.015, 100=0.006, 1000=0.00268, 2500=0.00233 (USD); Packaging: Cut Tape (CT); Part Status: Active; Tolerance: ±1%; Composition: Thick Film; Features: Moisture Resistant; Operating Temperature: -55°C ~ 155°C; Package / Case: 0603 (1608 Metric); Supplier Device Package: 0603; Size / Dimension: 0.063" L x 0.032" W (1.60mm x 0.80mm); Height - Seated (Max): 0.022" (0.55mm); Failure Rate: -; ComponentLink1URL: http://www.yageo.com/documents/recent/PYu-RC_Group_51_RoHS_L_8.pdf; ComponentLink1Description: http://www.yageo.com/documents/recent/PYu-RC_Group_51_RoHS_L_8.pdf
U2 U3 U5 U8 = PC817: Optoisolator Transistor Output 5000Vrms 1 Channel 4-SOP; Digikey: TPC817S1BRAGCT-ND

## Nets that join several sheets
3V3: [01]-POWER (C3.1 C4.1 R1.1 U1.5), [02]-ESP32 (7 pins), [03]-USB-UART (C18.1 IC1.6 R16.1 R17.1), [04]-OUTPUT (R14.1 R15.1 R24.1 R25.1)
+5V: [01]-POWER (7 pins), [04]-OUTPUT (20 pins)
GND: [01]-POWER (9 pins), [02]-ESP32 (12 pins), [03]-USB-UART (12 pins), [04]-OUTPUT (8 pins)
EN: [02]-ESP32 (5 pins), [03]-USB-UART (Q1.3)
ESP_OUT1: [02]-ESP32 (U4.30), [04]-OUTPUT (U8.2)
ESP_OUT2: [02]-ESP32 (U4.29), [04]-OUTPUT (U5.2)
ESP_OUT3: [02]-ESP32 (U4.28), [04]-OUTPUT (U2.2)
ESP_OUT4: [02]-ESP32 (U4.27), [04]-OUTPUT (U3.2)
IO0: [02]-ESP32 (HD3.4 U4.25), [03]-USB-UART (C14.1 Q2.3 R16.2 SW3.1)
LINE: [01]-POWER (F?.1 KF5.2), [04]-OUTPUT (K1.3 K2.3 K3.3 K4.3)
NEUTRAL: [01]-POWER (KF5.1 MD1.2 R3.1), [04]-OUTPUT (KF1.1 KF2.1 KF3.1 KF4.1)
RXD0/USB_TX: [02]-ESP32 (HD3.3 U4.34), [03]-USB-UART (R18.2)
TXD0/USB_RX: [02]-ESP32 (HD3.2 U4.35), [03]-USB-UART (R21.2)